# EAGLE design OST (EAGLE 9.6.2)
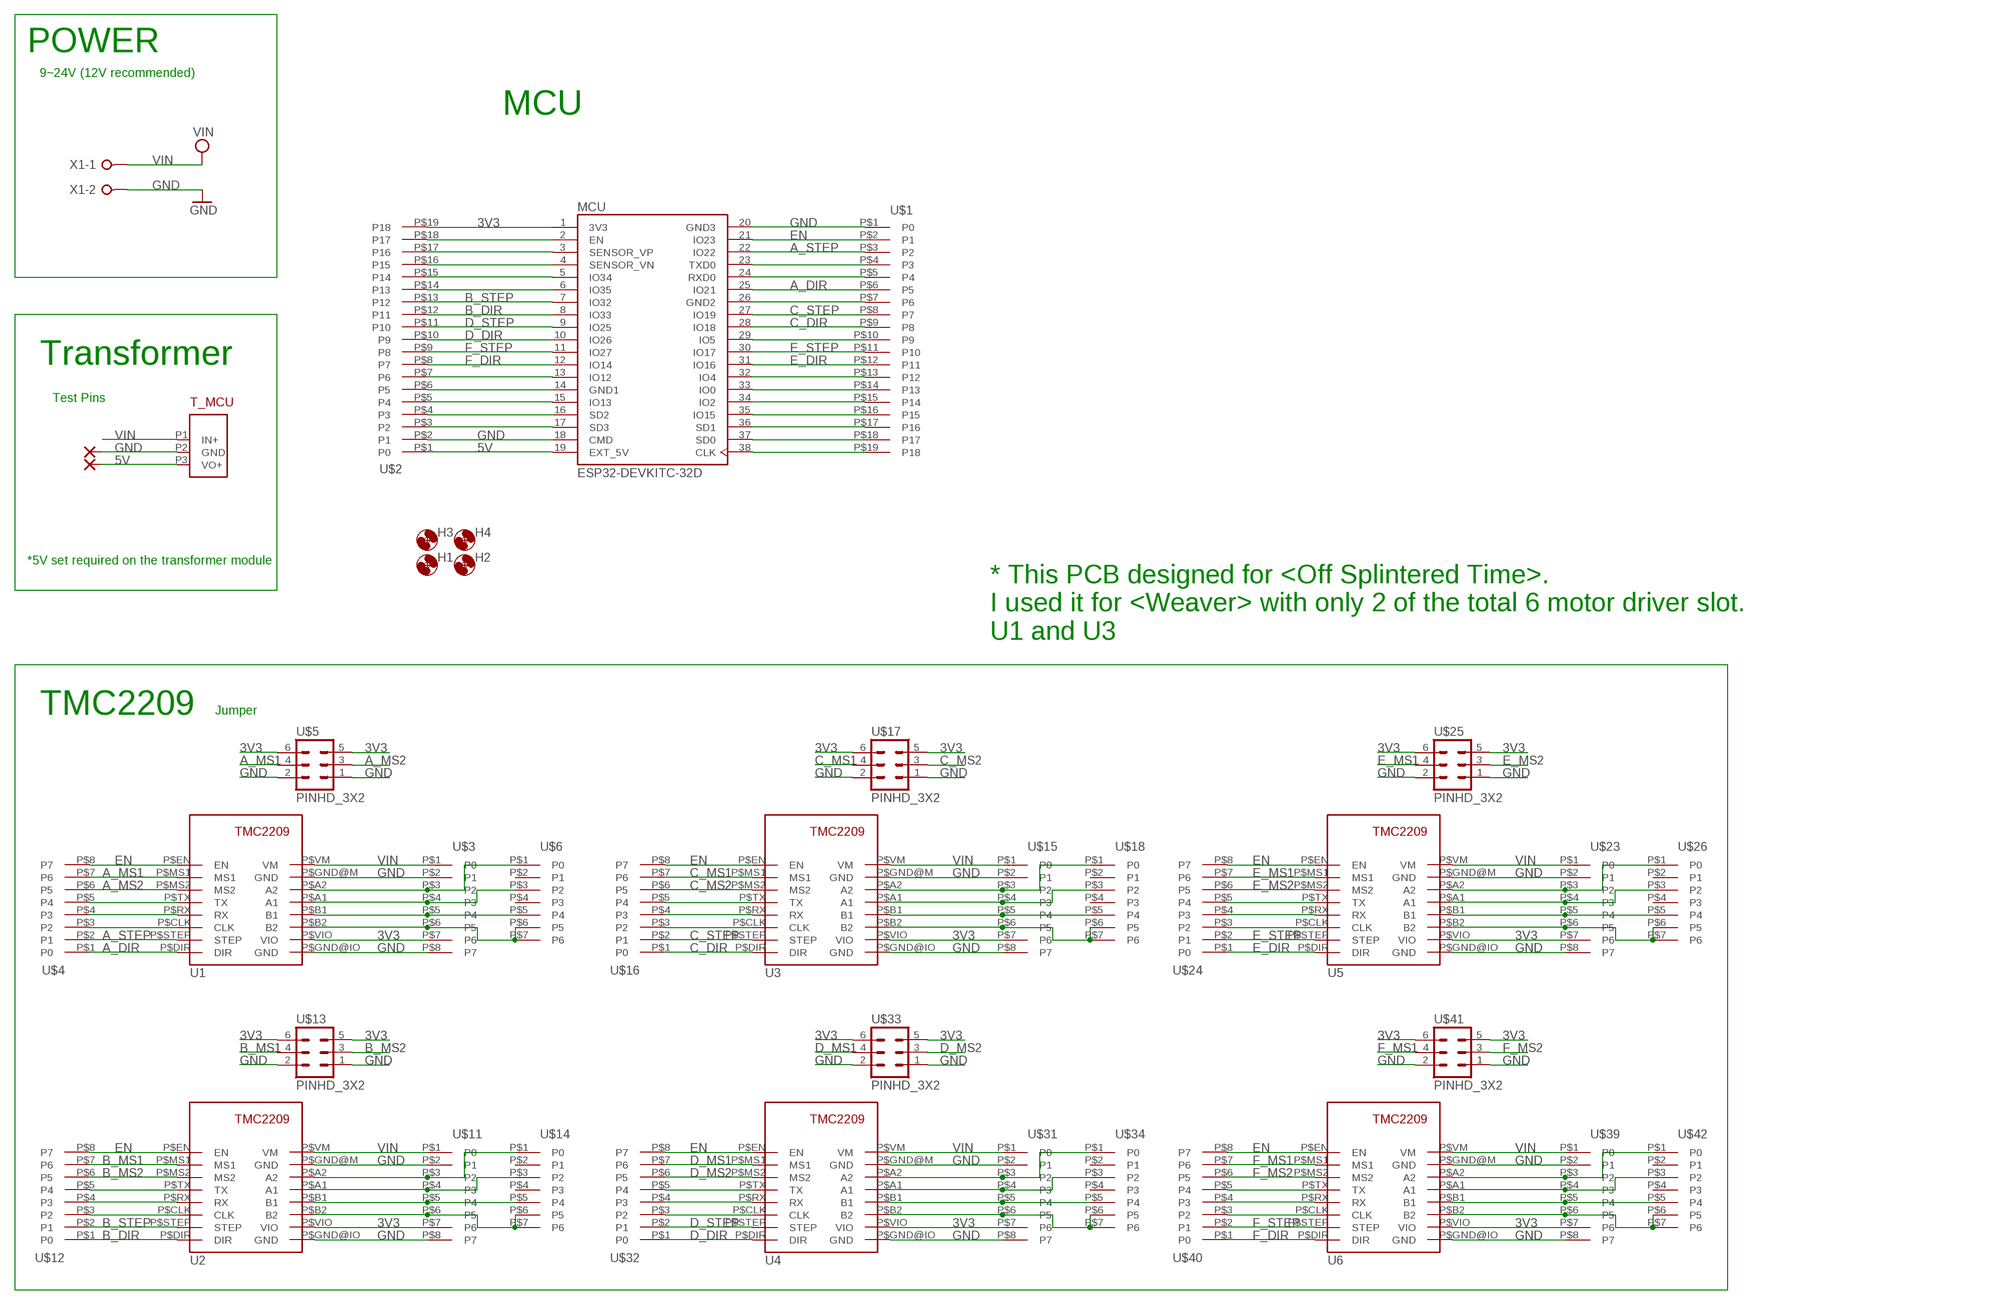
[diagram p0: schematic, sheet 1]

## Parts
H1  MOUNT-HOLE3.2  [3,2]
H2  MOUNT-HOLE3.2  [3,2]
H3  MOUNT-HOLE3.2  [3,2]
H4  MOUNT-HOLE3.2  [3,2]
MCU  ESP32-DEVKITC-32D  [MODULE_ESP32-DEVKITC-32D]
PAD16  2,15/1,0  [2,15/1,0]
PAD17  2,15/1,0  [2,15/1,0]
T_MCU  VOL_ADJ  [FREEVOL]
U1  TMC2209_V3.1  [TMC2209]
U2  TMC2209_V3.1  [TMC2209]
U3  TMC2209_V3.1  [TMC2209]
U4  TMC2209_V3.1  [TMC2209]
U5  TMC2209_V3.1  [TMC2209]
U6  TMC2209_V3.1  [TMC2209]
U$1  PINHD_1X19  [19]
U$2  PINHD_1X19  [19]
U$3  PINHD_1X8  [8]
U$4  PINHD_1X8  [8]
U$5  PINHD_3X2  [MA03-2]
U$6  PINHD_1X7  [7]
U$11  PINHD_1X8  [8]
U$12  PINHD_1X8  [8]
U$13  PINHD_3X2  [MA03-2]
U$14  PINHD_1X7  [7]
U$15  PINHD_1X8  [8]
U$16  PINHD_1X8  [8]
U$17  PINHD_3X2  [MA03-2]
U$18  PINHD_1X7  [7]
U$23  PINHD_1X8  [8]
U$24  PINHD_1X8  [8]
U$25  PINHD_3X2  [MA03-2]
U$26  PINHD_1X7  [7]
U$31  PINHD_1X8  [8]
U$32  PINHD_1X8  [8]
U$33  PINHD_3X2  [MA03-2]
U$34  PINHD_1X7  [7]
U$39  PINHD_1X8  [8]
U$40  PINHD_1X8  [8]
U$41  PINHD_3X2  [MA03-2]
U$42  PINHD_1X7  [7]
X1  W237-02P  [W237-132]

## Nets
3V3 [Motorline]: MCU.1(3V3) U1.P$VIO(VIO) U2.P$VIO(VIO) U3.P$VIO(VIO) U4.P$VIO(VIO) U5.P$VIO(VIO) U6.P$VIO(VIO) U$2.P$19(P18) U$3.P$7(P6) U$5.5 U$5.6 U$11.P$7(P6) U$13.5 U$13.6 U$15.P$7(P6) U$17.5 U$17.6 U$23.P$7(P6) U$25.5 U$25.6 U$31.P$7(P6) U$33.5 U$33.6 U$39.P$7(P6) U$41.5 U$41.6
5V: MCU.19(EXT_5V) PAD17.1(P) T_MCU.P3(VO+) U$2.P$1(P0)
A1 [Motorline]: U1.P$A1(A1) U$3.P$4(P3) U$6.P$3(P2)
A2 [Motorline]: U1.P$A2(A2) U$3.P$3(P2) U$6.P$1(P0)
A5 [Motorline]: U2.P$A2(A2) U$11.P$3(P2) U$14.P$1(P0)
A6 [Motorline]: U2.P$A1(A1) U$11.P$4(P3) U$14.P$3(P2)
A7 [Motorline]: U3.P$A2(A2) U$15.P$3(P2) U$18.P$1(P0)
A8 [Motorline]: U3.P$A1(A1) U$15.P$4(P3) U$18.P$3(P2)
A11 [Motorline]: U5.P$A2(A2) U$23.P$3(P2) U$26.P$1(P0)
A12 [Motorline]: U5.P$A1(A1) U$23.P$4(P3) U$26.P$3(P2)
A15 [Motorline]: U4.P$A2(A2) U$31.P$3(P2) U$34.P$1(P0)
A16 [Motorline]: U4.P$A1(A1) U$31.P$4(P3) U$34.P$3(P2)
A19 [Motorline]: U6.P$A2(A2) U$39.P$3(P2) U$42.P$1(P0)
A20 [Motorline]: U6.P$A1(A1) U$39.P$4(P3) U$42.P$3(P2)
A_DIR [Motorline]: MCU.25(IO21) U1.P$DIR(DIR) U$1.P$6(P5) U$4.P$1(P0)
A_MS1 [Motorline]: U1.P$MS1(MS1) U$4.P$7(P6) U$5.4
A_MS2 [Motorline]: U1.P$MS2(MS2) U$4.P$6(P5) U$5.3
A_STEP [Motorline]: MCU.22(IO22) U1.P$STEP(STEP) U$1.P$3(P2) U$4.P$2(P1)
B1 [Motorline]: U1.P$B1(B1) U$3.P$5(P4) U$6.P$5(P4)
B2 [Motorline]: U1.P$B2(B2) U$3.P$6(P5) U$6.P$6(P5) U$6.P$7(P6)
B5 [Motorline]: U2.P$B1(B1) U$11.P$5(P4) U$14.P$5(P4)
B6 [Motorline]: U2.P$B2(B2) U$11.P$6(P5) U$14.P$6(P5) U$14.P$7(P6)
B7 [Motorline]: U3.P$B1(B1) U$15.P$5(P4) U$18.P$5(P4)
B8 [Motorline]: U3.P$B2(B2) U$15.P$6(P5) U$18.P$6(P5) U$18.P$7(P6)
B11 [Motorline]: U5.P$B1(B1) U$23.P$5(P4) U$26.P$5(P4)
B12 [Motorline]: U5.P$B2(B2) U$23.P$6(P5) U$26.P$6(P5) U$26.P$7(P6)
B15 [Motorline]: U4.P$B1(B1) U$31.P$5(P4) U$34.P$5(P4)
B16 [Motorline]: U4.P$B2(B2) U$31.P$6(P5) U$34.P$6(P5) U$34.P$7(P6)
B19 [Motorline]: U6.P$B1(B1) U$39.P$5(P4) U$42.P$5(P4)
B20 [Motorline]: U6.P$B2(B2) U$39.P$6(P5) U$42.P$6(P5) U$42.P$7(P6)
B_DIR [Motorline]: MCU.8(IO33) U2.P$DIR(DIR) U$2.P$12(P11) U$12.P$1(P0)
B_MS1 [Motorline]: U2.P$MS1(MS1) U$12.P$7(P6) U$13.4
B_MS2 [Motorline]: U2.P$MS2(MS2) U$12.P$6(P5) U$13.3
B_STEP [Motorline]: MCU.7(IO32) U2.P$STEP(STEP) U$2.P$13(P12) U$12.P$2(P1)
C_DIR [Motorline]: MCU.28(IO18) U3.P$DIR(DIR) U$1.P$9(P8) U$16.P$1(P0)
C_MS1 [Motorline]: U3.P$MS1(MS1) U$16.P$7(P6) U$17.4
C_MS2 [Motorline]: U3.P$MS2(MS2) U$16.P$6(P5) U$17.3
C_STEP [Motorline]: MCU.27(IO19) U3.P$STEP(STEP) U$1.P$8(P7) U$16.P$2(P1)
D_DIR [Motorline]: MCU.10(IO26) U4.P$DIR(DIR) U$2.P$10(P9) U$32.P$1(P0)
D_MS1 [Motorline]: U4.P$MS1(MS1) U$32.P$7(P6) U$33.4
D_MS2 [Motorline]: U4.P$MS2(MS2) U$32.P$6(P5) U$33.3
D_STEP [Motorline]: MCU.9(IO25) U4.P$STEP(STEP) U$2.P$11(P10) U$32.P$2(P1)
E_DIR [Motorline]: MCU.31(IO16) U5.P$DIR(DIR) U$1.P$12(P11) U$24.P$1(P0)
E_MS1 [Motorline]: U5.P$MS1(MS1) U$24.P$7(P6) U$25.4
E_MS2 [Motorline]: U5.P$MS2(MS2) U$24.P$6(P5) U$25.3
E_STEP [Motorline]: MCU.30(IO17) U5.P$STEP(STEP) U$1.P$11(P10) U$24.P$2(P1)
EN [Motorline]: MCU.21(IO23) U1.P$EN(EN) U2.P$EN(EN) U3.P$EN(EN) U4.P$EN(EN) U5.P$EN(EN) U6.P$EN(EN) U$1.P$2(P1) U$4.P$8(P7) U$12.P$8(P7) U$16.P$8(P7) U$24.P$8(P7) U$32.P$8(P7) U$40.P$8(P7)
F_DIR [Motorline]: MCU.12(IO14) U6.P$DIR(DIR) U$2.P$8(P7) U$40.P$1(P0)
F_MS1 [Motorline]: U6.P$MS1(MS1) U$40.P$7(P6) U$41.4
F_MS2 [Motorline]: U6.P$MS2(MS2) U$40.P$6(P5) U$41.3
F_STEP [Motorline]: MCU.11(IO27) U6.P$STEP(STEP) U$2.P$9(P8) U$40.P$2(P1)
GND [Motorline]: MCU.18(CMD) MCU.20(GND3) PAD16.1(P) T_MCU.P2(GND) U1.P$GND@IO(GND) U1.P$GND@M(GND) U2.P$GND@IO(GND) U2.P$GND@M(GND) U3.P$GND@IO(GND) U3.P$GND@M(GND) U4.P$GND@IO(GND) U4.P$GND@M(GND) U5.P$GND@IO(GND) U5.P$GND@M(GND) U6.P$GND@IO(GND) U6.P$GND@M(GND) U$1.P$1(P0) U$2.P$2(P1) U$3.P$2(P1) U$3.P$8(P7) U$5.1 U$5.2 U$11.P$2(P1) U$11.P$8(P7) U$13.1 U$13.2 U$15.P$2(P1) U$15.P$8(P7) U$17.1 U$17.2 U$23.P$2(P1) U$23.P$8(P7) U$25.1 U$25.2 U$31.P$2(P1) U$31.P$8(P7) U$33.1 U$33.2 U$39.P$2(P1) U$39.P$8(P7) U$41.1 U$41.2 X1.2
N$4: U1.P$CLK(CLK) U$4.P$3(P2)
N$5: MCU.38(CLK) U$1.P$19(P18)
N$7: U2.P$CLK(CLK) U$12.P$3(P2)
N$8: MCU.2(EN) U$2.P$18(P17)
N$9: MCU.3(SENSOR_VP) U$2.P$17(P16)
N$10: MCU.4(SENSOR_VN) U$2.P$16(P15)
N$11: MCU.5(IO34) U$2.P$15(P14)
N$12: MCU.6(IO35) U$2.P$14(P13)
N$19: MCU.13(IO12) U$2.P$7(P6)
N$20: MCU.14(GND1) U$2.P$6(P5)
N$21: MCU.15(IO13) U$2.P$5(P4)
N$22: MCU.16(SD2) U$2.P$4(P3)
N$23: MCU.17(SD3) U$2.P$3(P2)
N$24: U3.P$CLK(CLK) U$16.P$3(P2)
N$25: MCU.37(SD0) U$1.P$18(P17)
N$26: MCU.36(SD1) U$1.P$17(P16)
N$27: MCU.35(IO15) U$1.P$16(P15)
N$28: MCU.34(IO2) U$1.P$15(P14)
N$29: MCU.33(IO0) U$1.P$14(P13)
N$30: MCU.32(IO4) U$1.P$13(P12)
N$33: MCU.29(IO5) U$1.P$10(P9)
N$36: MCU.26(GND2) U$1.P$7(P6)
N$38: MCU.24(RXD0) U$1.P$5(P4)
N$43: U5.P$CLK(CLK) U$24.P$3(P2)
N$45: U4.P$CLK(CLK) U$32.P$3(P2)
N$47: U6.P$CLK(CLK) U$40.P$3(P2)
P$444 [Motorline]: MCU.23(TXD0) U$1.P$4(P3)
RX [Motorline]: U1.P$RX(RX) U$4.P$4(P3)
RX2 [Motorline]: U2.P$RX(RX) U$12.P$4(P3)
RX3 [Motorline]: U3.P$RX(RX) U$16.P$4(P3)
RX5 [Motorline]: U5.P$RX(RX) U$24.P$4(P3)
RX7 [Motorline]: U4.P$RX(RX) U$32.P$4(P3)
RX9 [Motorline]: U6.P$RX(RX) U$40.P$4(P3)
TX [Motorline]: U1.P$TX(TX) U$4.P$5(P4)
TX2 [Motorline]: U2.P$TX(TX) U$12.P$5(P4)
TX3 [Motorline]: U3.P$TX(TX) U$16.P$5(P4)
TX5 [Motorline]: U5.P$TX(TX) U$24.P$5(P4)
TX7 [Motorline]: U4.P$TX(TX) U$32.P$5(P4)
TX9 [Motorline]: U6.P$TX(TX) U$40.P$5(P4)
VIN [VIN]: T_MCU.P1(IN+) U1.P$VM(VM) U2.P$VM(VM) U3.P$VM(VM) U4.P$VM(VM) U5.P$VM(VM) U6.P$VM(VM) U$3.P$1(P0) U$11.P$1(P0) U$15.P$1(P0) U$23.P$1(P0) U$31.P$1(P0) U$39.P$1(P0) X1.1
Unconnected: U$6.P$2(P1) U$6.P$4(P3) U$14.P$2(P1) U$14.P$4(P3) U$18.P$2(P1) U$18.P$4(P3) U$26.P$2(P1) U$26.P$4(P3) U$34.P$2(P1) U$34.P$4(P3) U$42.P$2(P1) U$42.P$4(P3)

## Notes on the sheet
- POWER
- 9~24V (12V recommended)
- MCU
- Transformer
- Test Pins
- *5V set required on the transformer module
- * This PCB designed for <Off Splintered Time>.
  I used it for <Weaver> with only 2 of the total 6 motor driver slot.
  U1 and U3
- TMC2209 | Jumper

## Library data of the parts
H1-H4 = holes:MOUNT-HOLE: MOUNTING HOLE with drill center marker
MCU = ESP32-DEVKITC-32D:ESP32-DEVKITC-32D: Eval Board For Esp-Wroom-32; MANUFACTURER: Espressif Systems; PARTREV: 4
PAD16 PAD17 = wirepad:2,15/1,0: THROUGH-HOLE PAD
T_MCU = FreeVol:VOL_ADJ: Free Voltage Adj. Max 24V 3A
U1-U6 = Trinamic:TMC2209_V3.1: TMC2209 v3.1
U$1 U$2 = PINHD:PINHD_1X19
U$3 U$4 U$11 U$12 U$15 U$16 U$23 U$24 U$31 U$32 U$39 U$40 = PINHD:PINHD_1X8
U$5 U$13 U$17 U$25 U$33 U$41 = PINHD:PINHD_3X2
U$6 U$14 U$18 U$26 U$34 U$42 = PINHD:PINHD_1X7
X1 = con-wago-508:W237-02P: WAGO SREW CLAMP; OC_FARNELL: unknown; OC_NEWARK: unknown

## Net classes
0 default: width 0.254 mm, drill 0.127 mm, clearance 0.127 mm
1 Motorline: width 0.381 mm, drill 0.127 mm, clearance 0.203 mm
2 VIN: width 2.54 mm, drill 0.889 mm, clearance 0.254 mm

## Board
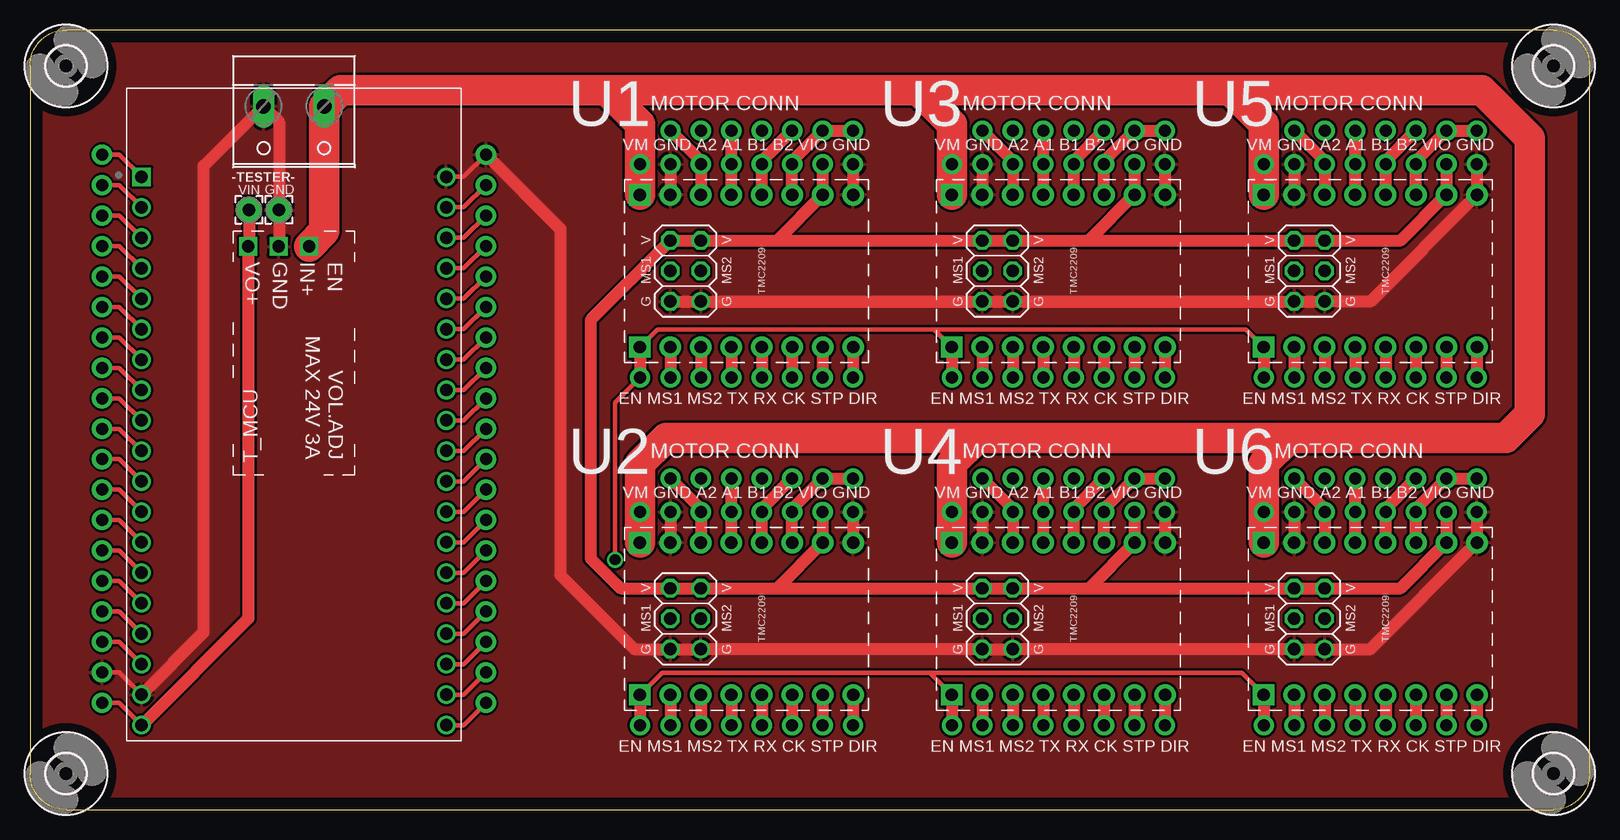
[diagram p1: board, top side]
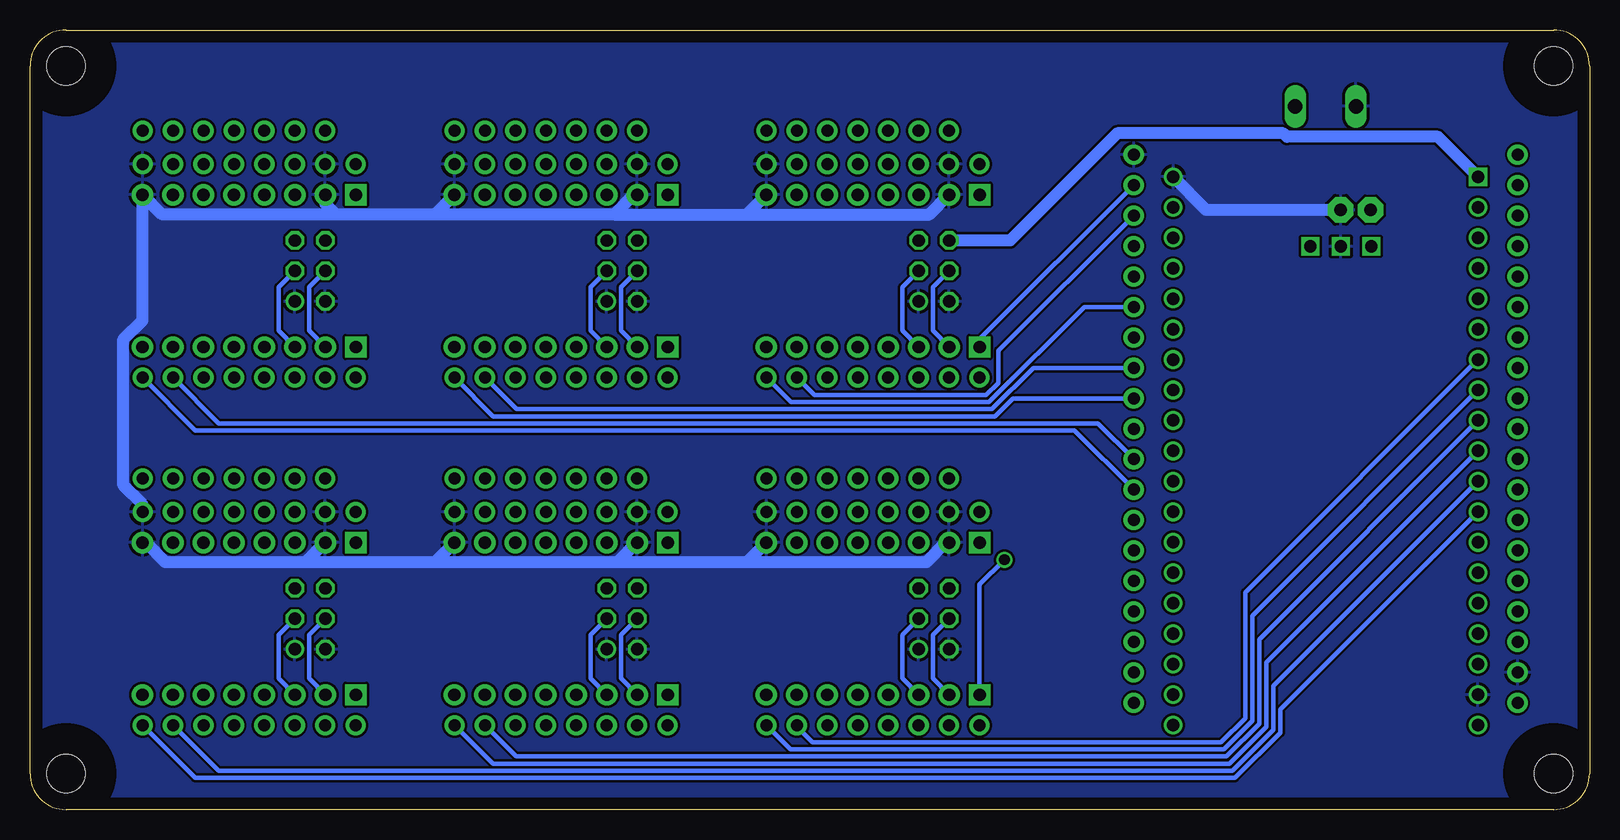
[diagram p2: board, bottom side, seen from below]

Size 130 x 65 mm. Coordinates in mm from the lower left corner, seen from the top.
Outline: 3,0 127,0 arc90 130,3 130,62 arc90 127,65 3,65 arc90 0,62 0,3 arc90 3,0
Copper layers (1*16): Top 0.035mm / dielectric 1.5mm / Bottom 0.035mm
Design rules "default": minimum track width 6mil, minimum drill 0.35mm, track to track 6mil, track to pad 6mil, pad to pad 6mil, via to via 6mil, smd to smd 6mil, copper to edge 40mil, drill to drill 6mil, minimum pad ring 10mil, minimum via ring 8mil, stop-mask expansion 4mil, vias tented up to drill 0mil, thermal gap 10mil

### Footprints (pad centres in the part's own frame; a part is rotated, then mirrored left to right if it is on the bottom)
3,2 = hole 3.2: 0,0
MODULE_ESP32-DEVKITC-32D = drill 1.04 square: 1 -12.7,19.76 | drill 1.04: 2 -12.7,17.22; 3 -12.7,14.68; 4 -12.7,12.14; 5 -12.7,9.6; 6 -12.7,7.06; 7 -12.7,4.52; 8 -12.7,1.98; 9 -12.7,-0.56; 10 -12.7,-3.1; 11 -12.7,-5.64; 12 -12.7,-8.18; 13 -12.7,-10.72; 14 -12.7,-13.26; 15 -12.7,-15.8; 16 -12.7,-18.34; 17 -12.7,-20.88; 18 -12.7,-23.42; 19 -12.7,-25.96; 20 12.7,19.76; 21 12.7,17.22; 22 12.7,14.68; 23 12.7,12.14; 24 12.7,9.6; 25 12.7,7.06; 26 12.7,4.52; 27 12.7,1.98; 28 12.7,-0.56; 29 12.7,-3.1; 30 12.7,-5.64; 31 12.7,-8.18; 32 12.7,-10.72; 33 12.7,-13.26; 34 12.7,-15.8; 35 12.7,-18.34; 36 12.7,-20.88; 37 12.7,-23.42; 38 12.7,-25.96
2,15/1,0 = drill 1.016 pad 2.159 octagon: 1 0,0
FREEVOL = drill 1.02 square: P1 -8.89,1.27; P2 -8.89,-1.27; P3 -8.89,-3.81
TMC2209 = drill 1.02 pad 1.778: P$A1 6.35,1.27; P$A2 6.35,3.81; P$B1 6.35,-1.27; P$B2 6.35,-3.81; P$CLK -6.35,-3.81; P$DIR -6.35,-8.89; P$GND@IO 6.35,-8.89; P$GND@M 6.35,6.35; P$MS1 -6.35,6.35; P$MS2 -6.35,3.81; P$RX -6.35,-1.27; P$STEP -6.35,-6.35; P$TX -6.35,1.27; P$VIO 6.35,-6.35 | drill 1.02 pad 1.778 square: P$EN -6.35,8.89; P$VM 6.35,8.89
19 = drill 1 pad 1.676: P$1 0,0; P$2 0,-2.54; P$3 0,-5.08; P$4 0,-7.62; P$5 0,-10.16; P$6 0,-12.7; P$7 0,-15.24; P$8 0,-17.78; P$9 0,-20.32; P$10 0,-22.86; P$11 0,-25.4; P$12 0,-27.94; P$13 0,-30.48; P$14 0,-33.02; P$15 0,-35.56; P$16 0,-38.1; P$17 0,-40.64; P$18 0,-43.18; P$19 0,-45.72
8 = drill 1 pad 1.676: P$1 0,0; P$2 0,-2.54; P$3 0,-5.08; P$4 0,-7.62; P$5 0,-10.16; P$6 0,-12.7; P$7 0,-15.24; P$8 0,-17.78
MA03-2 = drill 1.016: 1 -2.54,-1.27 | drill 1.016 octagon: 2 -2.54,1.27; 3 0,-1.27; 4 0,1.27; 5 2.54,-1.27; 6 2.54,1.27
7 = drill 1 pad 1.676: P$1 0,0; P$2 0,-2.54; P$3 0,-5.08; P$4 0,-7.62; P$5 0,-10.16; P$6 0,-12.7; P$7 0,-15.24
W237-132 = drill 1.194 long: 1 -2.54,-0.635; 2 2.54,-0.635

### Placement (x,y rotation side)
H1  127,3 180 top
H2  127,62 180 top
H3  3,3 0 top
H4  3,62 0 top
MCU  22,33 0 top
PAD16  20.75,50 0 top
PAD17  18.25,50 0 top
T_MCU  22,38.06 270 top
U1  59.73,44.91 90 top
U2  59.73,15.91 90 top
U3  85.73,44.91 90 top
U4  85.73,15.91 90 top
U5  111.73,44.91 90 top
U6  111.73,15.91 90 top
U$1  38,54.61 0 top
U$2  6,8.89 180 top
U$3  50.84,53.8 90 top
U$4  68.62,36.02 270 top
U$5  54.65,44.91 90 top
U$6  53.38,56.61 90 top
U$11  50.84,24.8 90 top
U$12  68.62,7.02 270 top
U$13  54.65,15.91 90 top
U$14  53.38,27.61 90 top
U$15  76.84,53.8 90 top
U$16  94.62,36.02 270 top
U$17  80.65,44.91 90 top
U$18  79.38,56.61 90 top
U$23  102.84,53.8 90 top
U$24  120.62,36.02 270 top
U$25  106.65,44.91 90 top
U$26  105.38,56.61 90 top
U$31  76.84,24.8 90 top
U$32  94.62,7.02 270 top
U$33  80.65,15.91 90 top
U$34  79.38,27.61 90 top
U$39  102.84,24.8 90 top
U$40  120.62,7.02 270 top
U$41  106.65,15.91 90 top
U$42  105.38,27.61 90 top
X1  22,58 180 top

### Tracks (layer width: path | path; a pad name or v marks a point on that pad's centre or on a via)
3V3
  Top 0.381: U$2.P$19 7.45,54.61 MCU.1
  Top 1: U$3.P$7 U1.P$VIO 62.27,47.45 | 62.27,47.45 U$5.5 U$5.6 46.74,40.81 46.74,20.92 49.21,18.45 U$13.6 U$13.5 62.27,18.45 | U$11.P$7 U2.P$VIO 62.27,18.45 | U$15.P$7 U3.P$VIO 88.27,47.45 | 88.27,47.45 U$17.5 U$17.6 62.27,47.45 | U$23.P$7 U5.P$VIO 114.27,47.45 U$25.5 U$25.6 88.27,47.45 | U$31.P$7 U4.P$VIO 88.27,18.45 | 88.27,18.45 U$33.5 U$33.6 62.27,18.45 | U$39.P$7 U6.P$VIO 114.27,18.45 U$41.5 U$41.6 88.27,18.45
  Bottom 1: MCU.1 12.63,56.09 25.22,56.09 25.52,56.39 39.37,56.39 48.31,47.45 U$5.6
5V
  Top 0.381: U$2.P$1 7.45,8.89 MCU.19
  Top 1: PAD17.1 18.25,47.02 T_MCU.P3 18.19,15.93 MCU.19
A1
  Top 1: U1.P$A1 U$3.P$4 U$6.P$3
A2
  Top 1: U$6.P$1 55.92,54.07 U$3.P$3 U1.P$A2
A5
  Top 1: U$14.P$1 55.92,25.07 U$11.P$3 U2.P$A2
A6
  Top 1: U2.P$A1 U$11.P$4 U$14.P$3
A7
  Top 1: U$18.P$1 81.92,54.07 U$15.P$3 U3.P$A2
A8
  Top 1: U3.P$A1 U$15.P$4 U$18.P$3
A11
  Top 1: U$26.P$1 107.92,54.07 U$23.P$3 U5.P$A2
A12
  Top 1: U5.P$A1 U$23.P$4 U$26.P$3
A15
  Top 1: U$34.P$1 81.92,25.07 U$31.P$3 U4.P$A2
A16
  Top 1: U4.P$A1 U$31.P$4 U$34.P$3
A19
  Top 1: U$42.P$1 107.92,25.07 U$39.P$3 U6.P$A2
A20
  Top 1: U6.P$A1 U$39.P$4 U$42.P$3
A_DIR
  Top 0.381: MCU.25 36.15,40.06 U$1.P$6
  Top 1: U1.P$DIR U$4.P$1
  Bottom 0.381: U$4.P$1 66.56,33.96 50.05,33.96 42.1,41.91 U$1.P$6
A_MS1
  Top 1: U1.P$MS1 U$4.P$7
  Bottom 0.381: U$5.4 54.74,43.55 54.74,39.92 U1.P$MS1
A_MS2
  Top 1: U1.P$MS2 U$4.P$6
  Bottom 0.381: U$5.3 57.28,43.55 57.28,39.92 U1.P$MS2
A_STEP
  Top 0.381: MCU.22 36.15,47.68 U$1.P$3
  Top 1: U1.P$STEP U$4.P$2
  Bottom 0.381: U$1.P$3 49.28,38.25 49.28,35.56 50.29,34.54 64.6,34.54 U$4.P$2
B1
  Top 1: U1.P$B1 U$3.P$5 61,54.07 U$6.P$5
B2
  Top 1: U1.P$B2 U$3.P$6 63.54,54.07 U$6.P$6 U$6.P$7
B5
  Top 1: U2.P$B1 U$11.P$5 61,25.07 U$14.P$5
B6
  Top 1: U2.P$B2 U$11.P$6 63.54,25.07 U$14.P$6 U$14.P$7
B7
  Top 1: U3.P$B1 U$15.P$5 87,54.07 U$18.P$5
B8
  Top 1: U3.P$B2 U$15.P$6 89.54,54.07 U$18.P$6 U$18.P$7
B11
  Top 1: U5.P$B1 U$23.P$5 113,54.07 U$26.P$5
B12
  Top 1: U5.P$B2 U$23.P$6 115.54,54.07 U$26.P$6 U$26.P$7
B15
  Top 1: U4.P$B1 U$31.P$5 87,25.07 U$34.P$5
B16
  Top 1: U4.P$B2 U$31.P$6 89.54,25.07 U$34.P$6 U$34.P$7
B19
  Top 1: U6.P$B1 U$39.P$5 113,25.07 U$42.P$5
B20
  Top 1: U6.P$B2 U$39.P$6 115.54,25.07 U$42.P$6 U$42.P$7
B_DIR
  Top 0.381: U$2.P$12 7.45,36.83 MCU.8
  Top 1: U2.P$DIR U$12.P$1
  Bottom 0.381: MCU.8 28.12,16.16 28.12,7.38 30.49,5 66.6,5 U$12.P$1
B_MS1
  Top 1: U2.P$MS1 U$12.P$7
  Bottom 0.381: U$13.4 54.74,14.54 54.74,10.93 U2.P$MS1
B_MS2
  Top 1: U2.P$MS2 U$12.P$6
  Bottom 0.381: U2.P$MS2 57.28,10.93 57.28,14.54 U$13.3
B_STEP
  Top 0.381: U$2.P$13 7.45,39.37 MCU.7
  Top 1: U2.P$STEP U$12.P$2
  Bottom 0.381: MCU.7 28.7,18.12 28.7,7.62 30.73,5.59 64.77,5.59 66.08,6.9 U$12.P$2
C_DIR
  Top 0.381: MCU.28 36.15,32.44 U$1.P$9
  Top 1: U3.P$DIR U$16.P$1
  Bottom 0.381: U$1.P$9 48.07,34.29 49.57,32.79 91.39,32.79 U$16.P$1
C_MS1
  Top 1: U3.P$MS1 U$16.P$7
  Bottom 0.381: U$17.4 80.75,43.55 80.75,39.92 U3.P$MS1
C_MS2
  Top 1: U3.P$MS2 U$16.P$6
  Bottom 0.381: U$17.3 83.28,43.55 83.28,39.92 U3.P$MS2
C_STEP
  Top 0.381: MCU.27 36.15,34.98 U$1.P$8
  Top 1: U3.P$STEP U$16.P$2
  Bottom 0.381: U$1.P$8 46.35,36.83 49.81,33.38 89.44,33.38 U$16.P$2
D_DIR
  Top 0.381: U$2.P$10 7.45,31.75 MCU.10
  Top 1: U4.P$DIR U$32.P$1
  Bottom 0.381: MCU.10 26.95,12.25 26.95,6.89 30.03,3.81 91.41,3.81 U$32.P$1
D_MS1
  Top 1: U4.P$MS1 U$32.P$7
  Bottom 0.381: U$33.4 80.75,14.54 80.75,10.93 U4.P$MS1
D_MS2
  Top 1: U4.P$MS2 U$32.P$6
  Bottom 0.381: U$33.3 83.28,14.54 83.28,10.93 U4.P$MS2
D_STEP
  Top 0.381: U$2.P$11 7.45,34.29 MCU.9
  Top 1: U4.P$STEP U$32.P$2
  Bottom 0.381: MCU.9 27.53,14.21 27.53,7.14 30.25,4.42 89.48,4.42 U$32.P$2
E_DIR
  Top 0.381: MCU.31 36.15,24.82 U$1.P$12
  Top 1: U5.P$DIR U$24.P$1
  Bottom 0.381: U$1.P$12 42.95,31.62 116.22,31.62 U$24.P$1
E_MS1
  Top 1: U5.P$MS1 U$24.P$7
  Bottom 0.381: U5.P$MS1 106.75,39.92 106.75,43.55 U$25.4
E_MS2
  Top 1: U5.P$MS2 U$24.P$6
  Bottom 0.381: U5.P$MS2 109.28,39.92 109.28,43.55 U$25.3
E_STEP
  Top 0.381: MCU.30 36.15,27.36 U$1.P$11
  Top 1: U5.P$STEP U$24.P$2
  Bottom 0.381: U$1.P$11 41,32.21 114.27,32.21 U$24.P$2
EN  (via drill 0.89)
  Top 0.381: MCU.21 36.15,50.22 U$1.P$2 | 75.36,40.03 52.31,40.03 U1.P$EN | 75.36,40.03 U3.P$EN | 75.36,40.03 101.36,40.03 U5.P$EN | 75,11.4 52.68,11.4 U2.P$EN | 75,11.4 U4.P$EN | 75,11.4 101,11.4 U6.P$EN | v48.77,20.83 48.77,33.95 U$4.P$8
  Top 1: U1.P$EN U$4.P$8 | U2.P$EN U$12.P$8 | U3.P$EN U$16.P$8 | U5.P$EN U$24.P$8 | U4.P$EN U$32.P$8 | U6.P$EN U$40.P$8
  Bottom 0.381: U$1.P$2 50.84,39.23 U1.P$EN | v48.77,20.83 50.84,18.76 U2.P$EN
F_DIR
  Top 0.381: U$2.P$8 7.45,26.67 MCU.12
  Top 1: U6.P$DIR U$40.P$1
  Bottom 0.381: MCU.12 25.78,8.34 25.78,6.41 29.55,2.64 116.24,2.64 U$40.P$1
F_MS1
  Top 1: U6.P$MS1 U$40.P$7
  Bottom 0.381: U6.P$MS1 106.75,10.93 106.75,14.54 U$41.4
F_MS2
  Top 1: U6.P$MS2 U$40.P$6
  Bottom 0.381: U6.P$MS2 109.28,10.93 109.28,14.54 U$41.3
F_STEP
  Top 0.381: U$2.P$9 7.45,29.21 MCU.11
  Top 1: U6.P$STEP U$40.P$2
  Bottom 0.381: MCU.11 26.36,10.29 26.36,6.65 29.79,3.23 114.29,3.23 U$40.P$2
GND
  Top 0.381: U$2.P$2 7.45,11.43 MCU.18 | MCU.20 36.15,52.76 U$1.P$1
  Top 1: T_MCU.P2 20.75,46.98 PAD16.1 20.75,57.34 X1.2 14.48,53.65 14.48,14.76 MCU.18 | U$3.P$8 U1.P$GND@IO | U$5.2 U$5.1 U$17.2 U$17.1 U$25.2 U$25.1 111.73,42.37 U5.P$GND@IO U$23.P$8 | U$11.P$8 U2.P$GND@IO | U$15.P$8 U3.P$GND@IO | U$31.P$8 U4.P$GND@IO | U$39.P$8 U6.P$GND@IO 111.73,13.37 U$41.1 U$41.2 U$33.1 U$33.2 U$13.1 U$13.2 50.38,13.37 44.2,19.56 44.2,48.41 U$1.P$1 | U$3.P$2 U1.P$GND@M | U$11.P$2 U2.P$GND@M | U$15.P$2 U3.P$GND@M | U$23.P$2 U5.P$GND@M | U$31.P$2 U4.P$GND@M | U$39.P$2 U6.P$GND@M
  Bottom 1: U5.P$GND@M 105.38,50.52 104.48,49.62 | U3.P$GND@M 79.67,51.26 81.31,49.62 | 81.31,49.62 96.26,49.62 | 96.26,49.62 104.48,49.62 | 96.26,49.62 U3.P$GND@IO | 81.31,49.62 70.26,49.62 | 70.26,49.62 55.02,49.62 U1.P$GND@M | 70.26,49.62 U1.P$GND@IO | 104.48,49.62 118.98,49.62 U5.P$GND@IO 120.62,40.81 122.21,39.22 122.21,27.02 120.62,25.43 U$39.P$8 | PAD16.1 31.94,50 MCU.20 | U2.P$GND@M 53.67,22.26 55.31,20.62 70.26,20.62 | U6.P$GND@IO 120.33,22.26 118.69,20.62 107.02,20.62 | 70.26,20.62 81.02,20.62 | 81.02,20.62 96.26,20.62 | 96.26,20.62 107.02,20.62 | 70.26,20.62 U2.P$GND@IO | 81.02,20.62 U4.P$GND@M | 96.26,20.62 U4.P$GND@IO | 107.02,20.62 U6.P$GND@M
  pour Top (isolate 0.127): -10,70 -10,-10 140,-10 140,70
  pour Bottom (isolate 0.127): -10,60 0,70 140,70 140,-10 -10,-10
N$4
  Top 1: U1.P$CLK U$4.P$3
N$5
  Top 0.381: MCU.38 36.15,7.04 U$1.P$19
N$7
  Top 1: U2.P$CLK U$12.P$3
N$8
  Top 0.381: U$2.P$18 7.45,52.07 MCU.2
N$9
  Top 0.381: U$2.P$17 7.45,49.53 MCU.3
N$10
  Top 0.381: U$2.P$16 7.45,46.99 MCU.4
N$11
  Top 0.381: U$2.P$15 7.45,44.45 MCU.5
N$12
  Top 0.381: U$2.P$14 7.45,41.91 MCU.6
N$19
  Top 0.381: U$2.P$7 7.45,24.13 MCU.13
N$20
  Top 0.381: U$2.P$6 7.45,21.59 MCU.14
N$21
  Top 0.381: U$2.P$5 7.45,19.05 MCU.15
N$22
  Top 0.381: U$2.P$4 7.45,16.51 MCU.16
N$23
  Top 0.381: U$2.P$3 7.45,13.97 MCU.17
N$24
  Top 1: U3.P$CLK U$16.P$3
N$25
  Top 0.381: MCU.37 36.15,9.58 U$1.P$18
N$26
  Top 0.381: MCU.36 36.15,12.12 U$1.P$17
N$27
  Top 0.381: MCU.35 36.15,14.66 U$1.P$16
N$28
  Top 0.381: MCU.34 36.15,17.2 U$1.P$15
N$29
  Top 0.381: MCU.33 36.15,19.74 U$1.P$14
N$30
  Top 0.381: MCU.32 36.15,22.28 U$1.P$13
N$33
  Top 0.381: MCU.29 36.15,29.9 U$1.P$10
N$36
  Top 0.381: MCU.26 36.15,37.52 U$1.P$7
N$38
  Top 0.381: MCU.24 36.15,42.6 U$1.P$5
N$43
  Top 1: U5.P$CLK U$24.P$3
N$45
  Top 1: U4.P$CLK U$32.P$3
N$47
  Top 1: U6.P$CLK U$40.P$3
P$444
  Top 0.381: MCU.23 36.15,45.14 U$1.P$4
RX
  Top 1: U1.P$RX U$4.P$4
RX2
  Top 1: U2.P$RX U$12.P$4
RX3
  Top 1: U3.P$RX U$16.P$4
RX5
  Top 1: U5.P$RX U$24.P$4
RX7
  Top 1: U4.P$RX U$32.P$4
RX9
  Top 1: U6.P$RX U$40.P$4
TX
  Top 1: U1.P$TX U$4.P$5
TX2
  Top 1: U2.P$TX U$12.P$5
TX3
  Top 1: U3.P$TX U$16.P$5
TX5
  Top 1: U5.P$TX U$24.P$5
TX7
  Top 1: U4.P$TX U$32.P$5
TX9
  Top 1: U6.P$TX U$40.P$5
VIN
  Top 2.54: T_MCU.P1 24.54,48.23 X1.1 25.91,60 48,60 | U1.P$VM U$3.P$1 50.84,57.16 48,60 | U2.P$VM U$11.P$1 50.84,28.84 53,31 79,31 | U3.P$VM U$15.P$1 76.84,57.16 74,60 | U5.P$VM U$23.P$1 102.84,57.16 100,60 | U4.P$VM U$31.P$1 76.84,28.84 79,31 | U6.P$VM U$39.P$1 102.84,28.84 105,31 | 48,60 74,60 | 74,60 100,60 | 100,60 121,60 125,56 125,33 123,31 105,31 | 105,31 79,31

### Text on the board
tPlace: MOTOR CONN | MOTOR CONN | MOTOR CONN | VM GND A2 A1 B1 B2 VIO GND | VM GND A2 A1 B1 B2 VIO GND | VM GND A2 A1 B1 B2 VIO GND | -TESTER- | VIN | GND | EN MS1 MS2 TX RX CK STP DIR | EN MS1 MS2 TX RX CK STP DIR | EN MS1 MS2 TX RX CK STP DIR | MOTOR CONN | MOTOR CONN | MOTOR CONN | VM GND A2 A1 B1 B2 VIO GND | VM GND A2 A1 B1 B2 VIO GND | VM GND A2 A1 B1 B2 VIO GND | EN MS1 MS2 TX RX CK STP DIR | EN MS1 MS2 TX RX CK STP DIR | EN MS1 MS2 TX RX CK STP DIR